# Altium schematic sheet U_I_Meter_WIFI.SchDoc
size A2; SheetNumber: 1; SheetTotal: 1; SPICEModelCacheKLKQCPMB: <root> / <DocumentId>KLKQCPMB</DocumentId> / <CacheFrame Number="0"> / <Model Name="7850_744775147_47u" Kind="CKT"> / <Text>******* / .subckt 7850_744775147_47u 1 2 / Rp 1 2 40000 / Cp 1 2 4p / Rs 1 N3 0.1343 / L1 N3 2 47u / .ends 7850_744775147_47u</Text> / </Model> / </CacheFrame> / </root>
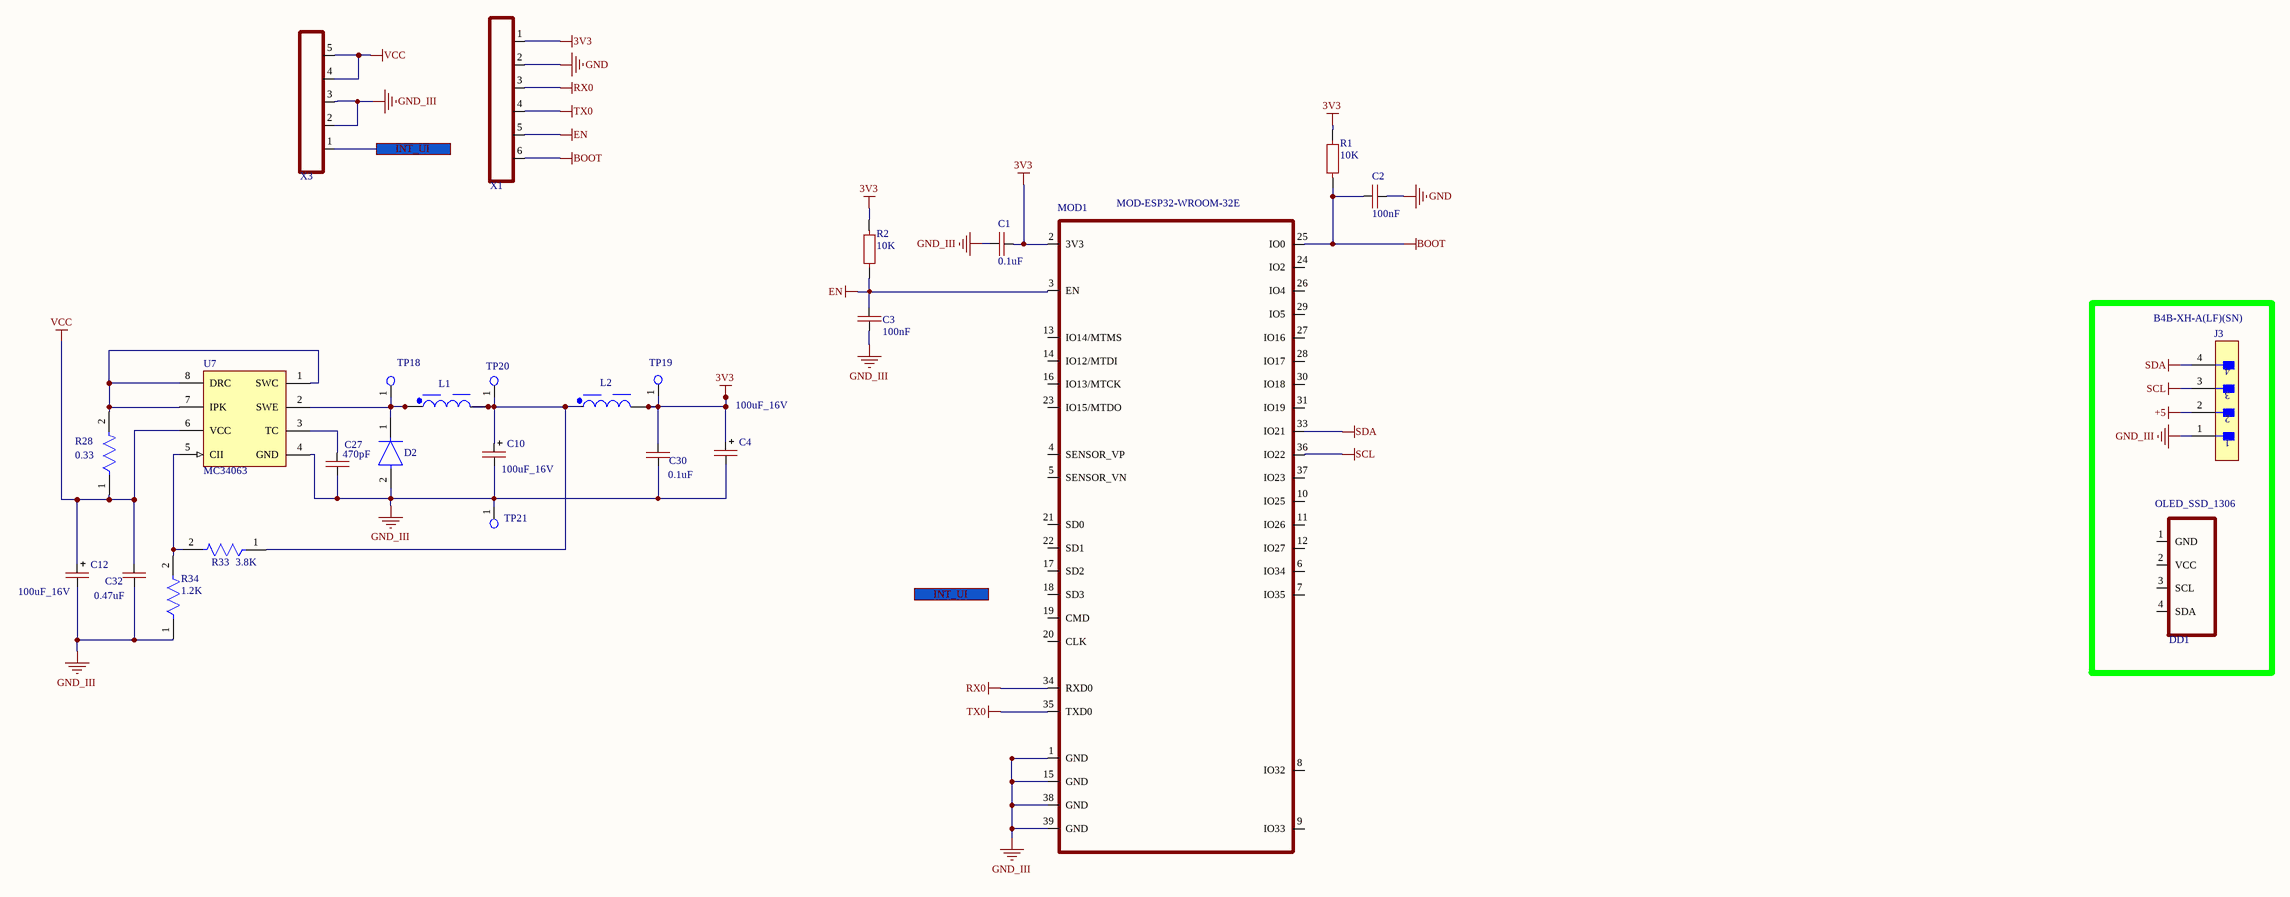
[diagram p0: U_I_Meter_WIFI.SchDoc]

## Parts
C1  0.1uF  [CAP-0805]
C2  100nF  [CAP-0805]
C3  100nF  [CAP-0805]
C4  100uF_16V  [CAP-TAN-D]
C10  100uF_16V  [CAP-TAN-D]
C12  100uF_16V  [CAP-TAN-D]
C27  470pF  [CAP-0805]
C30  0.1uF  [CAP-0805]
C32  0.47uF  [CAP-0805]
D2  US1G  [US1G_SMA]  (value not drawn)
DD1  OLED_SSD_1306  [OLED_128x64_SSD_1306]
J3  B4B-XH-A(LF)(SN)  [B4B-XH-A]
L1  47µH, 1.17A  [WE-PD2_7850]  (value not drawn)
L2  47µH, 1.17A  [WE-PD2_7850]  (value not drawn)
MOD1  MOD-ESP32-WROOM-32E  [MOD-ESP32-WROOM-32E]
R1  10K  [RES-0805]
R2  10K  [RES-0805]
R28  0.33  [RES-1206]
R33  3.8K  [RES-0805]
R34  1.2K  [RES-0805]
TP18  Test_Point_PCB  [Test_Point]  (value not drawn)
TP19  Test_Point_PCB  [Test_Point]  (value not drawn)
TP20  Test_Point_PCB  [Test_Point]  (value not drawn)
TP21  Test_Point_PCB  [Pin_Test_Point(Orange)]  (value not drawn)
U7  MC34063  [SOIC-8_M]
X1  CONN-6-PIN  [CONN-PLS-6-2.00mm]  (value not drawn)
X3  CONN-5-PIN  [CONN-PLS-5-2.54_2]  (value not drawn)

## Ports
INT_UI (see U_I_Meter_WIFI[3A]), INT_UI (see U_I_Meter_WIFI[4B])

## Nets
3V3: C1.2 C4.1(+) C30.2 L2.2 MOD1.2(3V3) R1.2 R2.1 TP19.1(G9) X1.1
+5: J3.2
BOOT: C2.2 MOD1.25(IO0) R1.1 X1.6
EN: C3.1 MOD1.3(EN) R2.2 X1.5
GND: C2.1 X1.2
GND_III: C1.1 C3.2 C4.2(-) C10.2(-) C12.2(-) C27.2 C30.1 C32.2 D2.2(A) J3.1 MOD1.1(GND) MOD1.15(GND) MOD1.38(GND) MOD1.39(GND) R34.1 TP21.1(G9) U7.4(GND) X3.2 X3.3
RX0: MOD1.34(RXD0) X1.3
SCL: J3.3 MOD1.36(IO22)
SDA: J3.4 MOD1.33(IO21)
TX0: MOD1.35(TXD0) X1.4
VCC: C12.1(+) C32.1 R28.1 U7.6(VCC) X3.4 X3.5
INT_UI: X3.1 ; port INT_UI
NetC10_1: C10.1(+) L1.2 L2.1 R33.1 TP20.1(G9)
NetC27_1: C27.1 U7.3(TC)
NetD2_1: D2.1(C) L1.1 TP18.1(G9) U7.2(SWE)
NetR28_2: R28.2 U7.1(SWC) U7.7(IPK) U7.8(DRC)
NetR33_2: R33.2 R34.2 U7.5(CII)

Not connected (* = marked no-connect by the designer): DD1 1(GND) 2(VCC) 3(SCL) 4(SDA); MOD1 4(SENSOR_VP) 5(SENSOR_VN) 6(IO34) 7(IO35) 8(IO32) 9(IO33) 10(IO25) 11(IO26) 12(IO27) 13(IO14/MTMS) 14(IO12/MTDI) 16(IO13/MTCK) 17(SD2) 18(SD3) 19(CMD) 20(CLK) 21(SD0) 22(SD1) 23(IO15/MTDO) 24(IO2) 26(IO4) 27(IO16) 28(IO17) 29(IO5) 30(IO18) 31(IO19) 37(IO23)

## Library data of the parts
C1-C3 C27 C30 C32 = CAP-NON-POLAR
C4 C10 C12 = CAP_POL_SMD
L1 L2 = 744775147: WE-PD2 SMT Power Inductor, size 7850, 47µH, 1.17A, 0.18Ω; Manufacturer: Wurth Elektronik; Case/Size Code: 7850; DC Resistance: 0.134Ω; Saturation Current: 1.24A; Self Resonant Frequency: 12MHz; Manufacturer Part Number: 744775147; Category: Unshielded Power Inductors; Match Code: WE-PD2; ComponentLink1Description: Website Link; ComponentLink1URL: https://www.we-online.com/redexpert/article/744775147?ad; ComponentLink2Description: Datasheet Link; ComponentLink2URL: https://www.we-online.com/redexpert/spec/744775147?ad; Mount: Surface Mount; Operating Temperature Max: 125°C; Operating Temperature Min: -40°C; Packaging: Tape and Reel; Length: 7.8mm; Width: 7mm; Height: 4.95mm; DC Resistance Max: 0.18Ω; Inductance: 47µH; Rated Current: 1.17A
R1 R2 R28 R34 = RES-CONST
R33 = RES-CONST: 10K
TP18-TP21 = TP_PCB?: Test_Point